# EAGLE design interface module (EAGLE 9.6.2)
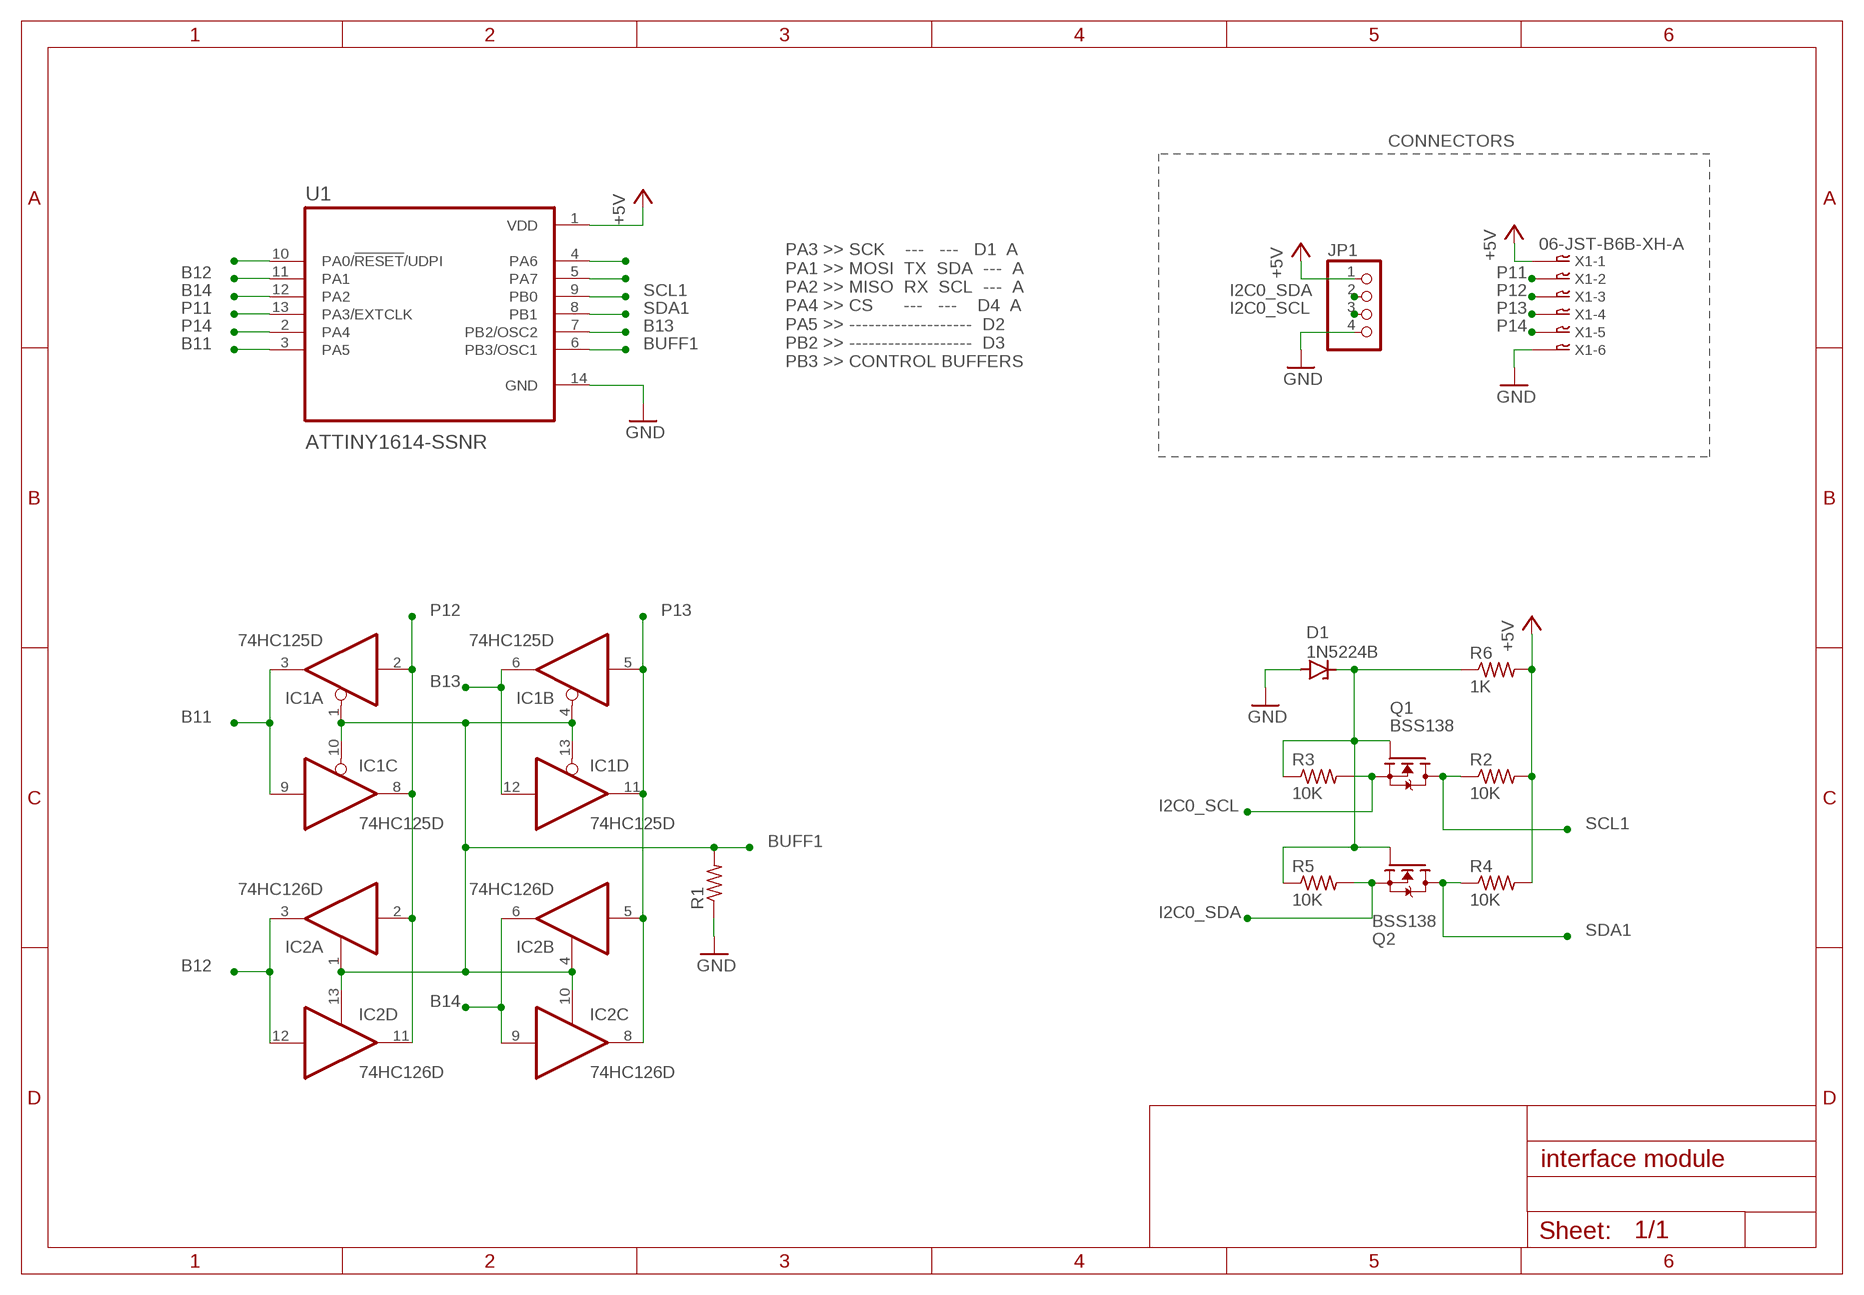
[diagram p0: schematic, sheet 1]

## Parts
D1  1N5224B  ZENER-DIODEDO34-7  [DO34Z7]
IC1  74HC125D  [SO14]
IC2  74HC126D  [SO14]
JP1  PINHD-1X4  [1X04]
Q1  BSS138  [SOT95P240X111-3N]
Q2  BSS138  [SOT95P240X111-3N]
R1  R-US_R0805  [R0805]
R2  10K  R-US_R0805  [R0805]
R3  10K  R-US_R0805  [R0805]
R4  10K  R-US_R0805  [R0805]
R5  10K  R-US_R0805  [R0805]
R6  1K  R-US_R0805  [R0805]
U1  ATTINY1614-SSNR  [SOIC127P600X175-14N]
X1  06-JST-B6B-XH-A  [B6B-XH]

## Nets
+5V: JP1.1 R2.2 R4.2 R6.2 U1.1(VDD) X1.P$1
B11: IC1.3(A:O) IC1.9(C:I) U1.3(PA5)
B12: IC2.3(A:O) IC2.12(D:I) U1.11(PA1)
B13: IC1.6(B:O) IC1.12(D:I) U1.7(PB2/OSC2)
B14: IC2.6(B:O) IC2.9(C:I) U1.12(PA2)
BUFF1: IC1.1(A:OE) IC1.4(B:OE) IC1.10(C:OE) IC1.13(D:OE) IC2.1(A:OE) IC2.4(B:OE) IC2.10(C:OE) IC2.13(D:OE) R1.2 U1.6(PB3/OSC1)
GND: D1.A JP1.4 R1.1 U1.14(GND) X1.P$6
I2C0_SCL: JP1.3 Q1.2(S) R3.2
I2C0_SDA: JP1.2 Q2.2(S) R5.2
N$2: U1.10(PA0/!RESET!/UDPI)
N$44: D1.C Q1.1(G) Q2.1(G) R3.1 R5.1 R6.1
N$48: U1.5(PA7)
N$49: U1.4(PA6)
P11: U1.13(PA3/EXTCLK) X1.P$2
P12: IC1.2(A:I) IC1.8(C:O) IC2.2(A:I) IC2.11(D:O) X1.P$3
P13: IC1.5(B:I) IC1.11(D:O) IC2.5(B:I) IC2.8(C:O) X1.P$4
P14: U1.2(PA4) X1.P$5
SCL1: Q1.3(D) R2.1 U1.9(PB0)
SDA1: Q2.3(D) R4.1 U1.8(PB1)

## Notes on the sheet
- CONNECTORS
- PA3 >> SCK    ---   ---   D1  A 
  PA1 >> MOSI  TX  SDA  ---  A
  PA2 >> MISO  RX  SCL  ---  A
  PA4 >> CS      ---   ---    D4  A
  PA5 >> -------------------  D2
  PB2 >> -------------------  D3
  PB3 >> CONTROL BUFFERS

## Power pins joined to a net without a drawn wire
GND: IC1.7(P:GND) IC2.7(P:GND)
VCC: IC1.14(P:VCC) IC2.14(P:VCC)

## Library data of the parts
D1 = diode:ZENER-DIODE: Z-Diode
IC1 = 74xx-eu:74*125: Quad bus BUFFER, 3-state
IC2 = 74xx-eu:74*126: Quad bus BUFFER, 3-state
JP1 = pinhead:PINHD-1X4: PIN HEADER
Q1 Q2 = BSS138:BSS138: N-Channel 50V 220mA (Ta) 360mW (Ta) Surface Mount SOT-23-3 Check availability <https://pricing.snapeda.com/parts/BSS138/ON%20Semiconductor/view-part?ref=eda>; AVAILABILITY: In Stock; DESCRIPTION: N-Channel 50 V 200mA (Ta) 225mW (Ta) Surface Mount SOT-23-3 (TO-236); MF: ON Semiconductor; MP: BSS138; PACKAGE: SOT-23 ON; PRICE: None; PURCHASE-URL: https://pricing.snapeda.com/search/part/BSS138/?ref=eda
R1-R6 = rcl:R-US_: RESISTOR, American symbol; SPICEPREFIX: R
U1 = ATTINY1614-SSNR:ATTINY1614-SSNR: 20MHz, SOIC, 85C, Green, 14 SOIC .150in T/R Check availability <https://pricing.snapeda.com/parts/ATTINY1614-SSNR/Microchip/view-part?ref=eda>; AVAILABILITY: In Stock; DESCRIPTION: AVR tinyAVR™ 1, Functional Safety (FuSa) Microcontroller IC 8-Bit 20MHz 16KB (16K x 8) FLASH 14-SOIC; MF: Microchip; MP: ATTINY1614-SSNR; PACKAGE: SO-14 Microchip; PRICE: None; PURCHASE-URL: https://pricing.snapeda.com/search/part/ATTINY1614-SSNR/?ref=eda
X1 = jst:06-JST: JST CONNECTOR

## Board
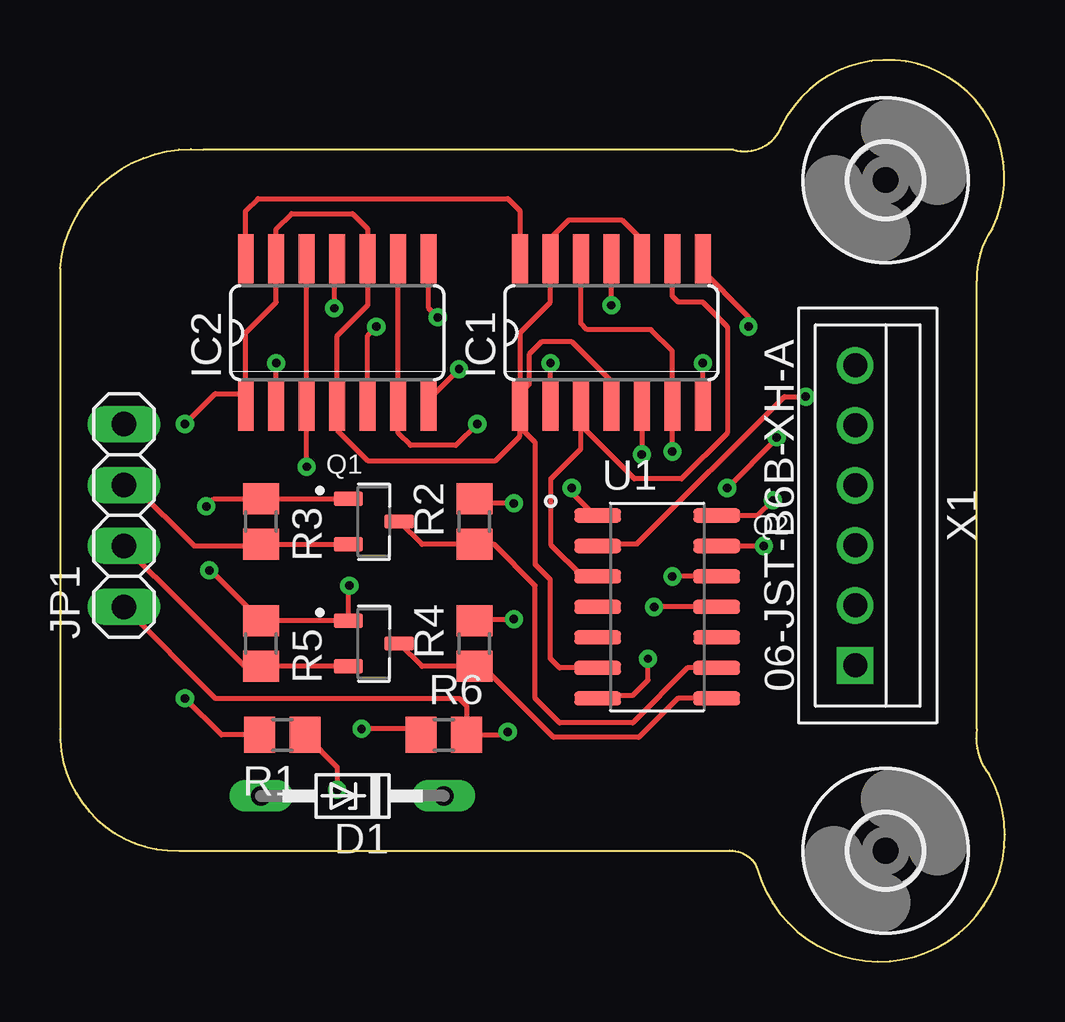
[diagram p1: board, top side]
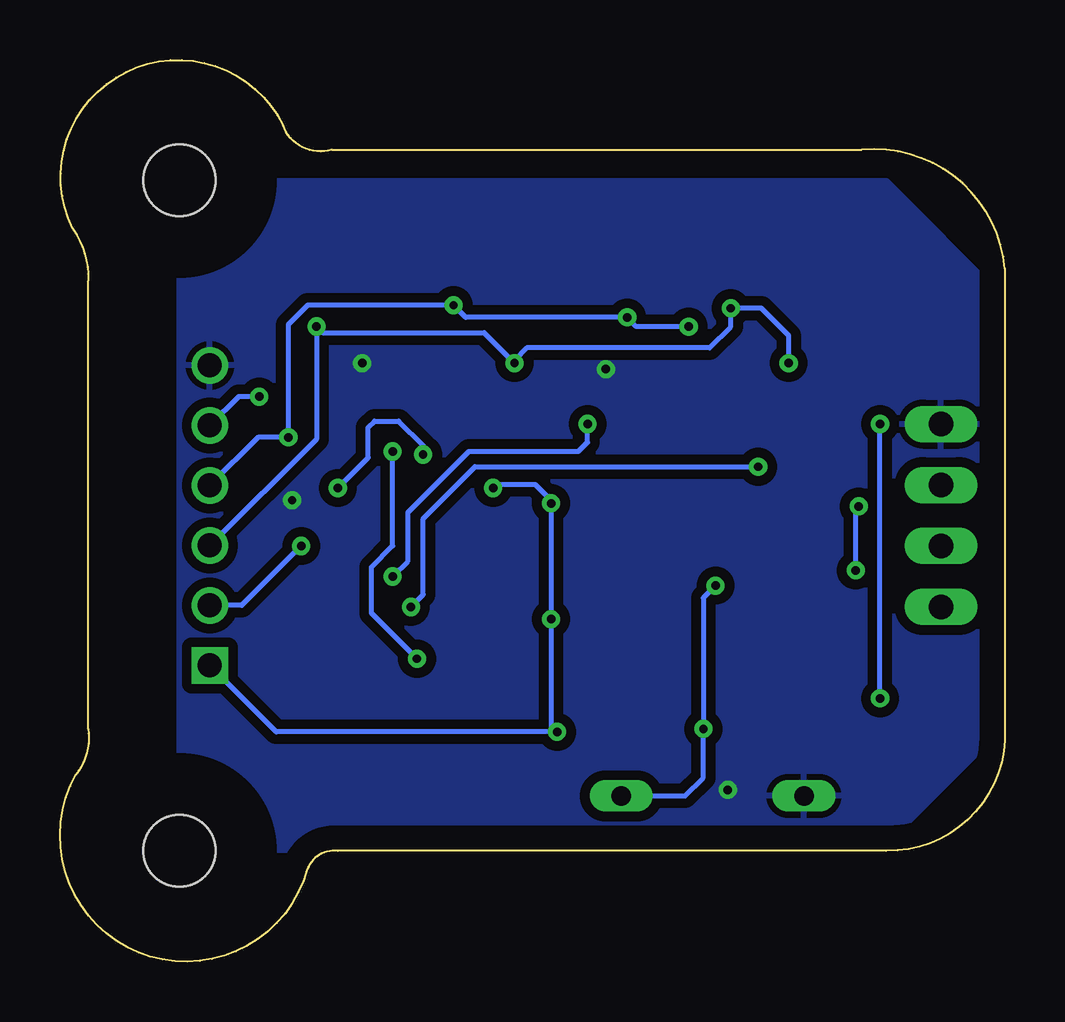
[diagram p2: board, bottom side, seen from below]

Size 39.39 x 37.57 mm. Coordinates in mm from the lower left corner, seen from the top.
Outline: 4.95,4.62 27.81,4.62 arc-75 29.08,3.86 arc194 38.73,7.8 arc-49 38.23,9.7 38.23,28.37 arc-38 38.86,30.53 arc180 30.1,34.85 arc-86 28.07,33.83 5.97,33.83 arc90 0,28.88 0,9.7 arc94 4.95,4.62
Copper layers (1*16): Top 0.035mm / dielectric 1.5mm / Bottom 0.035mm
Design rules "default *": minimum track width 6mil, minimum drill 0.35mm, track to track 16mil, track to pad 16mil, pad to pad 16mil, via to via 16mil, smd to smd 16mil, copper to edge 40mil, drill to drill 6mil, minimum pad ring 10mil, minimum via ring 8mil, stop-mask expansion 4mil, vias tented up to drill 0mil, thermal gap 10mil

### Footprints (pad centres in the part's own frame; a part is rotated, then mirrored left to right if it is on the bottom)
DO34Z7 = drill 0.813 long: A 3.81,0; C -3.81,0
SO14 = smd 0.66 x 2.032: 1 -3.81,-3.073; 2 -2.54,-3.073; 3 -1.27,-3.073; 4 0,-3.073; 5 1.27,-3.073; 6 2.54,-3.073; 7 3.81,-3.073; 8 3.81,3.073; 9 2.54,3.073; 10 1.27,3.073; 11 0,3.073; 12 -1.27,3.073; 13 -2.54,3.073; 14 -3.81,3.073
1X04 = drill 1.016 long: 1 -3.81,0; 2 -1.27,0; 3 1.27,0; 4 3.81,0
SOT95P240X111-3N = smd 1.23 x 0.6: 1 -1.06,0.95; 2 -1.06,-0.95; 3 1.06,0
R0805 = smd 1.3 x 1.5: 1 -0.95,0; 2 0.95,0
SOIC127P600X175-14N = smd 1.95 x 0.59: 1 -2.48,3.81; 2 -2.48,2.54; 3 -2.48,1.27; 4 -2.48,0; 5 -2.48,-1.27; 6 -2.48,-2.54; 7 -2.48,-3.81; 8 2.48,-3.81; 9 2.48,-2.54; 10 2.48,-1.27; 11 2.48,0; 12 2.48,1.27; 13 2.48,2.54; 14 2.48,3.81
3,0 = hole 3: 0,0
B6B-XH = drill 1 square: P$1 6.25,0 | drill 1: P$2 3.75,0; P$3 1.25,0; P$4 -1.25,0; P$5 -3.75,0; P$6 -6.25,0

### Placement (x,y rotation side)
D1  12.19,6.91 180 top
IC1  22.99,26.21 0 top
IC2  11.56,26.21 0 top
JP1  2.67,18.59 90 top
Q1  13.08,18.34 0 top
Q2  13.08,13.26 0 top
R1  9.27,9.45 180 top
R2  17.27,18.34 90 top
R3  8.38,18.34 270 top
R4  17.27,13.26 90 top
R5  8.38,13.26 270 top
R6  16,9.45 0 top
U1  24.89,14.78 0 top
U$1  [3,0]  34.42,4.62 0 top
U$2  [3,0]  34.42,32.56 0 top
X1  33.15,18.59 270 top

### Tracks (layer width: path | path; a pad name or v marks a point on that pad's centre or on a via)
+5V  (via drill 0.35)
  Top 0.203: v18.67,9.57 18.54,9.45 R6.2 16.95,10.66 16.64,10.97 6.48,10.97 JP1.1 | v18.92,19.1 17.46,19.1 R2.2 | U1.1 22.29,18.59 21.34,19.54 v21.34,19.74 | R4.2 17.34,14.27 v18.92,14.27
  Bottom 0.203: v21.34,19.74 21.19,19.89 19.58,19.89 18.92,19.23 v18.92,19.1 v18.92,14.27 18.92,9.83 v18.67,9.57 30.38,9.57 X1.P$1
B11
  Top 0.203: IC1.9 25.53,27.74 25.78,27.48 26.8,27.48 27.81,26.47 27.81,22.02 25.91,20.12 23.95,20.12 21.72,22.34 | 21.72,22.34 21.72,21.37 20.45,20.1 20.45,17.38 21.78,16.05 U1.3 | 21.72,22.34 IC1.3
B12  (via drill 0.35)
  Top 0.203: IC2.12 IC2.3 v10.29,20.62 | U1.11 v24.77,14.78
  Bottom 0.203: v24.77,14.78 24.26,15.29 24.26,18.46 22.1,20.62 v10.29,20.62
B13  (via drill 0.35)
  Top 0.203: IC1.12 21.72,26.59 21.97,26.34 24.64,26.34 25.53,25.45 IC1.6 v25.53,21.26 | U1.7 22.54,11.1 23.88,11.1 24.51,11.73 v24.51,12.62
  Bottom 0.203: v24.51,12.62 26.41,14.52 26.41,16.44 25.53,17.32 v25.53,21.26
B14  (via drill 0.35)
  Top 0.203: IC2.9 IC2.6 14.1,22.02 14.61,21.51 16.51,21.51 v17.4,22.4 | U1.12 v25.53,16.05
  Bottom 0.203: v25.53,16.05 24.89,16.69 24.89,18.72 22.35,21.26 17.78,21.26 17.4,21.64 v17.4,22.4
BUFF1  (via drill 0.35)
  Top 0.203: IC2.1 7.75,23.67 | 7.75,23.67 7.75,26.21 9.02,27.48 IC2.13 9.02,30.53 9.65,31.16 12.19,31.16 12.83,30.53 IC2.10 12.83,27.35 11.56,26.08 IC2.4 11.56,22.15 12.83,20.88 18.16,20.88 19.18,21.89 19.18,22.27 | 19.18,23.67 19.18,26.21 20.45,27.48 IC1.13 20.45,30.15 21.21,30.91 23.43,30.91 24.26,30.08 IC1.10 | 19.18,23.67 IC1.1 19.18,22.27 | IC1.4 22.99,24.18 21.34,25.83 21.33,25.83 20.08,25.83 19.56,25.31 19.56,24.06 19.18,23.67 | U1.6 20.83,12.24 20.45,12.62 20.45,15.92 19.81,16.56 19.81,21.64 19.18,22.27 | R1.2 6.73,9.45 v5.21,10.97 | v5.21,22.4 6.48,23.67 7.75,23.67
  Bottom 0.203: v5.21,10.97 v5.21,22.4
GND  (via drill 0.35)
  Top 0.203: IC2.7 15.37,23.42 v16.64,24.69 | IC1.7 v26.8,24.94 | R1.1 11.56,8.11 v11.56,7.16 | v29.72,19.23 29.08,18.59 U1.14
  pour Bottom: 0.13,9.7 5.21,4.62 34.42,4.62 34.42,32.56 4.95,32.56 0.13,27.74
I2C0_SCL
  Top 0.203: Q1.2 R3.2 8.32,17.32 5.59,17.32 3.05,19.86 JP1.3
I2C0_SDA
  Top 0.203: Q2.2 R5.2 7.7,12.31 3.96,16.05 3.94,16.05 JP1.2
N$44  (via drill 0.35)
  Top 0.203: Q1.1 R3.1 6.41,19.29 v6.1,18.97 | v12.57,9.7 14.8,9.7 R6.1 | v12.07,15.67 12.02,15.63 Q2.1 R5.1 6.28,16.31 v6.22,16.31
  Bottom 0.203: D1.C 13.34,6.91 12.57,7.67 v12.57,9.7 12.57,15.16 v12.07,15.67 | v6.22,16.31 6.22,18.85 v6.1,18.97
P11  (via drill 0.35)
  Top 0.203: U1.13 v29.34,17.32
  Bottom 0.203: v29.34,17.32 31.82,14.84 X1.P$2
P12  (via drill 0.35)
  Top 0.203: IC2.2 v9.02,24.94 | IC2.11 11.43,29.16 v11.43,27.23 | IC1.2 v20.45,24.94 | IC1.8 26.67,29.16 26.67,28.9 28.7,26.87 v28.7,26.47
  Bottom 0.203: X1.P$3 33.13,17.34 28.7,21.77 v28.7,26.47 28.45,26.21 21.72,26.21 v20.45,24.94 20.45,25.07 19.94,25.58 12.32,25.58 11.43,26.47 v11.43,27.23 10.16,27.23 9.02,26.08 v9.02,24.94
P13  (via drill 0.35)
  Top 0.203: IC2.5 12.83,26.1 v13.19,26.46 | v15.75,26.85 15.37,27.23 IC2.8 | v22.99,27.35 IC1.11 | IC1.5 v24.26,21.13 | v27.81,19.73 29.88,21.8 v29.88,21.85
  Bottom 0.203: v13.19,26.46 15.36,26.46 v15.75,26.85 22.48,26.85 v22.99,27.35 29.07,27.35 29.88,26.55 v29.88,21.85 31.14,21.85 X1.P$4 | v27.81,19.73 26.54,21 26.54,22.27 26.29,22.53 25.27,22.53 24.26,21.51 v24.26,21.13
P14  (via drill 0.35)
  Top 0.203: U1.2 22.5,17.41 24.06,17.41 30.2,23.54 v31.09,23.54
  Bottom 0.203: v31.09,23.54 31.94,23.54 X1.P$5
SCL1
  Top 0.203: Q1.3 15.09,17.39 R2.1 18.09,17.39 19.81,15.67 19.81,10.97 20.83,9.96 23.88,9.96 26.16,12.24 U1.9
SDA1
  Top 0.203: Q2.3 15.09,12.31 R4.1 17.61,12.31 20.57,9.35 24.13,9.35 25.75,10.97 U1.8
VCC
  Top 0.203: IC2.14 7.75,31.29 8.26,31.8 18.67,31.8 19.18,31.29 IC1.14